# EAGLE design nucleum_logger (EAGLE 6.6.0)
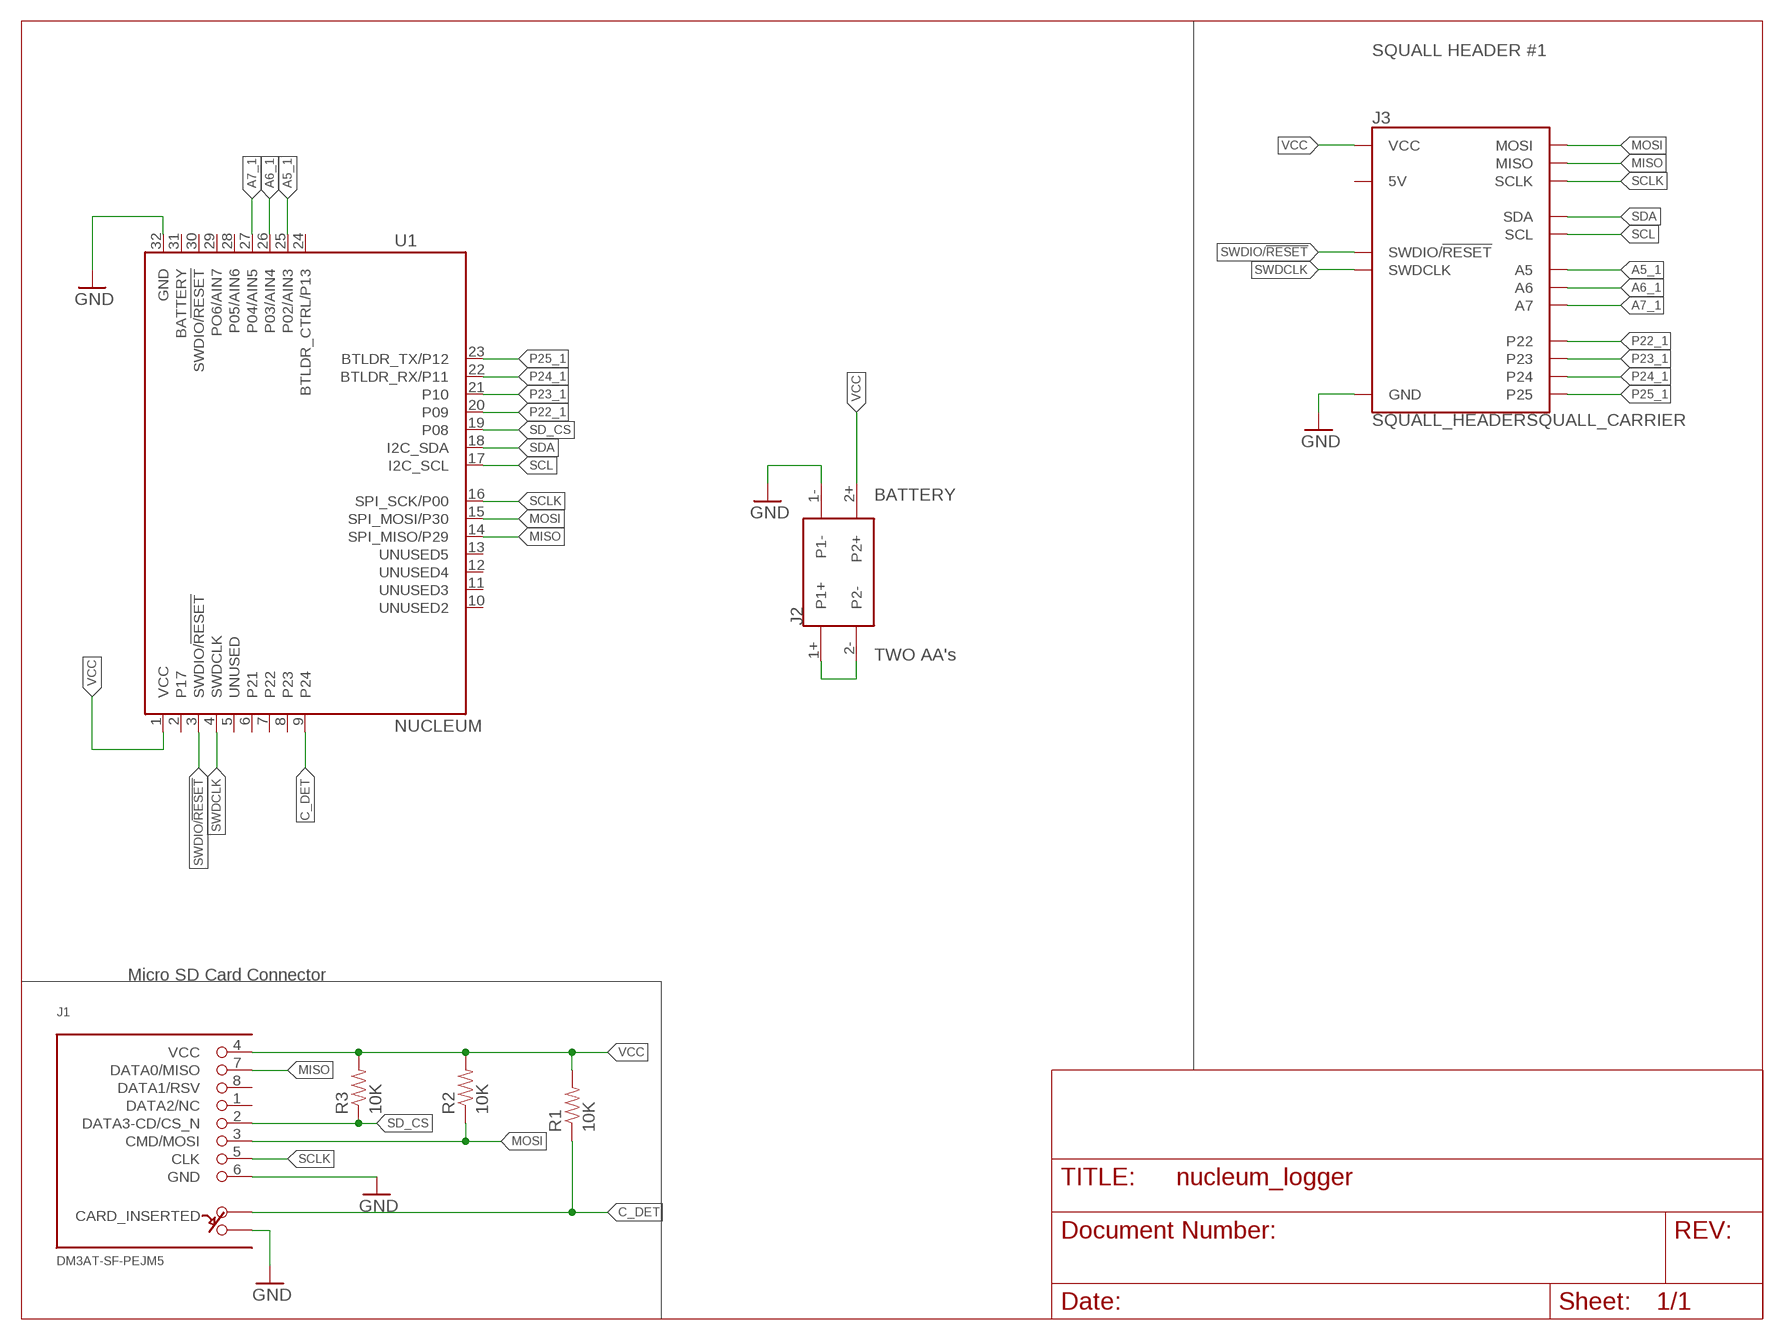
[diagram p0: schematic, sheet 1]

## Parts
J1  DM3AT-SF-PEJM5  [DM3AT-SF-PEJM5]
J2  AA_BAT_PACKSMD  [AA_SMD]
J3  SQUALL_HEADERSQUALL_CARRIER  [SQUALL_CARRIER]
R1  10K  RESISTOR0402_RES  [0402_RES]
R2  10K  RESISTOR0402_RES  [0402_RES]
R3  10K  RESISTOR0402_RES  [0402_RES]
U1  NUCLEUM  [NUCLEUM]

## Nets
A5_1: J3.B9(A5) U1.25(P02/AIN3)
A6_1: J3.B7(A6) U1.26(P03/AIN4)
A7_1: J3.B5(A7) U1.27(P04/AIN5)
C_DET: J1.A R1.1 U1.9(P24)
GND: J1.6(GND) J1.B J2.1- J3.A9(GND) J3.A10(GND) U1.32(GND)
MISO: J1.7(DATA0/MISO) J3.B8(MISO) U1.14(SPI_MISO/P29)
MOSI: J1.3(CMD/MOSI) J3.B6(MOSI) R2.1 U1.15(SPI_MOSI/P30)
N$1: J2.1+ J2.2-
P22_1: J3.A2(P22) U1.20(P09)
P23_1: J3.A4(P23) U1.21(P10)
P24_1: J3.A6(P24) U1.22(BTLDR_RX/P11)
P25_1: J3.A8(P25) U1.23(BTLDR_TX/P12)
SCL: J3.B3(SCL) U1.17(I2C_SCL)
SCLK: J1.5(CLK) J3.B10(SCLK) U1.16(SPI_SCK/P00)
SD_CS: J1.2(DATA3-CD/CS_N) R3.1 U1.19(P08)
SDA: J3.B1(SDA) U1.18(I2C_SDA)
SWDCLK: J3.B2(SWDCLK) U1.4(SWDCLK)
SWDIO/!RESET: J3.B4(SWDIO/!RESET) U1.3(SWDIO/!RESET)
VCC: J1.4(VCC) J2.2+ J3.A1(VCC) J3.A3(VCC) R1.2 R2.2 R3.2 U1.1(VCC)
Unconnected: J1.1(DATA2/NC) J1.8(DATA1/RSV) J3.A5(5V) J3.A7(5V) U1.2(P17) U1.5(UNUSED) U1.6(P21) U1.7(P22) U1.8(P23) U1.10(UNUSED2) U1.11(UNUSED3) U1.12(UNUSED4) U1.13(UNUSED5) U1.24(BTLDR_CTRL/P13) U1.28(P05/AIN6) U1.29(PO6/AIN7) U1.30(SWDIO/!RESET) U1.31(BATTERY)

## Notes on the sheet
- SQUALL HEADER #1
- BATTERY
- TWO AA's
- Micro SD Card Connector

## Library data of the parts
J1 = connector:DM3AT-SF-PEJM5: CONN MICRO SD R/A PUSH-PUSH SMD; DIGIKEY: HR1964CT-ND
J2 = connector:AA_BAT_PACK: Types of AA Battery Packs
J3 = squall:SQUALL_HEADER: Header for a sensor board on top of the Squall BLE tag board. Requires two DF40C-10DS-0.4V(51).
R1-R3 = passives:RESISTOR: Resistor Basic schematic elements and footprints for 0603, 1206, and PTH resistors.
U1 = nucleum:NUCLEUM: Nucleum sensorboard prototyping module.

## Board
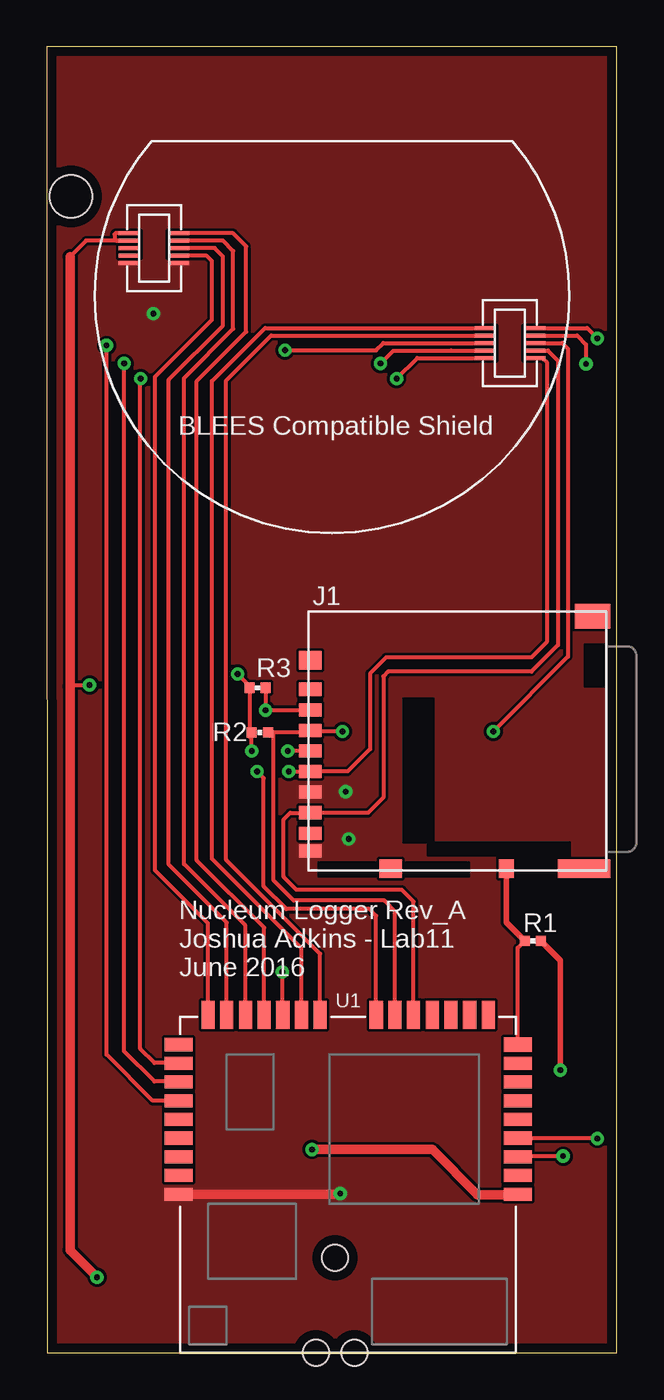
[diagram p1: board, top side]
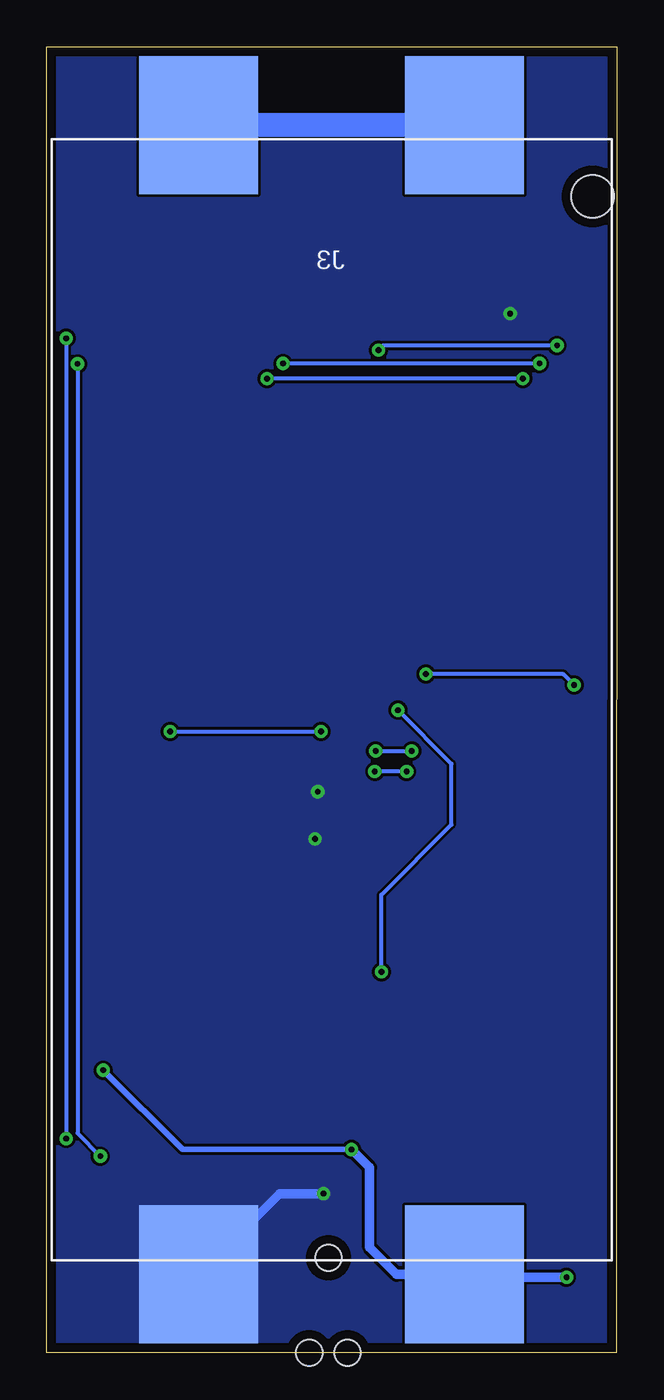
[diagram p2: board, bottom side, seen from below]

Size 30.51 x 69.85 mm. Coordinates in mm from the lower left corner, seen from the top.
Outline: 0.03,0 30.51,0 30.51,69.85 0,69.85 0.03,0
Copper layers (1*16): Top 0.0178mm / dielectric 59mil / Bottom 0.0178mm
Design rules "sunstone-2lyr_v1.0.0.3": minimum track width 6mil, minimum drill 14mil, track to track 6mil, track to pad 6mil, pad to pad 6mil, via to via 6mil, smd to smd 6mil, copper to edge 20mil, drill to drill 16mil, minimum pad ring 8mil, minimum via ring 8mil, stop-mask expansion 3mil, vias tented up to drill 50mil, thermal gap 10mil

### Footprints (pad centres in the part's own frame; a part is rotated, then mirrored left to right if it is on the bottom)
DM3AT-SF-PEJM5 = smd 0.7 x 1.2: 1 3.2,-0.1; 2 2.1,-0.1; 3 1,-0.1; 4 -0.1,-0.1; 5 -1.2,-0.1; 6 -2.3,-0.1; 7 -3.4,-0.1; 8 -4.5,-0.1; B -5.45,-0.1 | smd 1 x 0.8: A -6.4,-10.6 | smd 1 x 1.2: MOUNT0 4.75,-0.1; MOUNT1 -6.4,-4.4 | smd 1 x 2.8: MOUNT2 -6.4,-14.75 | smd 1.3 x 1.9: MOUNT3 7.1,-15.2
AA_SMD = smd 6.35 x 7.366: 1+ -7.112,30.734; 1- -7.112,-30.734; 2+ 7.112,-30.734; 2- 7.112,30.734 | hole 2.286: 13.97,26.924
SQUALL_CARRIER = smd 1.14 x 0.2: A1 -10.845,3.34; A2 -8.205,3.34; A3 -10.845,2.94; A4 -8.205,2.94; A5 -10.845,2.54; A6 -8.205,2.54; A7 -10.845,2.14; A8 -8.205,2.14; A9 -10.845,1.74; A10 -8.205,1.74; B1 8.205,-1.74; B2 10.845,-1.74; B3 8.205,-2.14; B4 10.845,-2.14; B5 8.205,-2.54; B6 10.845,-2.54; B7 8.205,-2.94; B8 10.845,-2.94; B9 8.205,-3.34; B10 10.845,-3.34
0402_RES = smd 0.536 x 0.546: 1 -0.433,0; 2 0.433,0
NUCLEUM = smd 0.7 x 1.5: 1 -9.479,-9.079; 2 -8.479,-9.079; 3 -7.479,-9.079; 4 -6.479,-9.079; 5 -5.479,-9.079; 6 -4.479,-9.079; 7 -3.479,-9.079; 8 -2.479,-9.079; 24 -1.479,9.079; 25 -2.479,9.079; 26 -3.479,9.079; 27 -4.479,9.079; 28 -5.479,9.079; 29 -6.479,9.079; 30 -7.479,9.079; 31 -8.479,9.079; 32 -9.479,9.079 | smd 0.754 x 1.5: 9 -1.479,-9.079 | smd 1.5 x 0.7: 10 0.1,-7.5; 11 0.1,-6.5; 12 0.1,-5.5; 13 0.1,-4.5; 14 0.1,-3.5; 15 0.1,-2.5; 16 0.1,-1.5; 17 0.1,1.5; 18 0.1,2.5; 19 0.1,3.5; 20 0.1,4.5; 21 0.1,5.5; 22 0.1,6.5; 23 0.1,7.5 | hole 1.4: -17.96,-0.33; -17.96,1.72; -12.88,0.7

### Placement (x,y rotation side)
J1  14,32.28 90 top
J2  15.27,34.92 0 bottom
J3  15.27,56.54 0 top
R1  26.01,22.02 0 top
R2  11.4,33.17 180 top
R3  11.28,35.56 180 top
U1  16.13,17.96 90 top

### Tracks (layer width: path | path; a pad name or v marks a point on that pad's centre or on a via)
A5_1  (via drill 0.3 pad 0.61)
  Top 0.203: U1.25 7.04,15.49 5.77,15.49 5,16.26 5,52.09 v5.03,52.09 | v18.72,52.09 19.82,53.2 J3.B9
  Bottom 0.203: v5.03,52.09 v18.72,52.09
A6_1  (via drill 0.3 pad 0.61)
  Top 0.203: U1.26 7.03,14.5 5.77,14.5 4.14,16.13 v4.14,52.91 | v17.86,52.91 18.54,53.59 21.51,53.59 21.63,53.6 J3.B7
  Bottom 0.203: v4.14,52.91 v17.86,52.91
A7_1  (via drill 0.3 pad 0.61)
  Top 0.203: U1.27 5.67,13.48 3.2,15.95 v3.2,53.87 | v12.75,53.62 17.63,53.62 18.01,54 J3.B5
  Bottom 0.203: v3.2,53.87 12.5,53.87 v12.75,53.62
C_DET
  Top 0.203: U1.9 25.21,21.65 R1.1 | 24.71,25.77 J1.A
  Top 0.305: R1.1 24.6,23 J1.A
GND  (via drill 0.3 pad 0.61)
  Top 0.508: U1.32 15.67,8.48 v15.7,8.51
  Bottom 0.508: v15.7,8.51 18.06,8.51 J2.1-
  other vias: 16,30 16.15,27.48 5.72,55.58
  pour Top (no thermals): 0.03,0 -0.03,69.88 30.48,69.85 30.51,0.03
  pour Bottom (no thermals): 0.03,0 -0.03,69.88 30.48,69.85 30.51,0.03
MISO
  Top 0.203: U1.14 19.63,24.14 19,24.77 13.36,24.77 12.67,25.45 12.67,28.52 13.03,28.88 J1.7 17.2,28.88 18.01,29.69 18.01,36.17 18.26,36.42 25.93,36.42 27.36,37.85 27.36,53.06 26.82,53.6 J3.B8
MOSI  (via drill 0.3 pad 0.61)
  Top 0.203: U1.15 18.63,23.61 18.06,24.18 13.21,24.18 12.14,25.25 12.14,33.2 | 12.14,33.2 14.01,33.2 J1.3 14.16,33.22 v15.82,33.22 | 12.14,33.2 R2.1 | J3.B6 27.58,54 27.89,53.7 27.89,37.24 v23.9,33.22
  Bottom 0.203: v23.9,33.22 v15.82,33.22
N$1
  Bottom 1.27: J2.2- J2.1+
P22_1
  Top 0.203: U1.20 11.63,22.74 8.03,26.34 8.03,51.97 10.67,54.61 10.67,59.18 9.98,59.87 7.07,59.87 J3.A2
P23_1
  Top 0.203: U1.21 10.63,22.85 7.34,26.14 7.34,52.12 9.98,54.76 9.98,58.93 9.42,59.49 J3.A4
P24_1
  Top 0.203: U1.22 9.63,23.01 6.53,26.11 6.53,52.05 9.42,54.94 9.42,58.62 8.99,59.08 J3.A6
P25_1
  Top 0.203: U1.23 8.63,22.97 5.79,25.81 5.79,52.2 8.84,55.24 8.84,58.4 8.56,58.67 J3.A8
SCL
  Top 0.203: U1.17 14.63,21.34 9.6,26.36 9.6,51.99 12.01,54.41 J3.B3
SCLK  (via drill 0.3 pad 0.61)
  Top 0.203: U1.16 17.63,23.37 17.27,23.72 12.83,23.72 11.61,24.94 11.61,30.73 v11.25,31.09 | v12.95,31.09 J1.5 16.1,31.09 17.3,32.28 17.3,36.32 18.16,37.19 25.93,37.19 26.75,38 26.75,52.98 26.53,53.2 J3.B10
  Bottom 0.203: v11.25,31.09 v12.95,31.09
SD_CS  (via drill 0.3 pad 0.61)
  Top 0.203: 14.09,34.39 J1.2 14.08,34.37 v11.71,34.37 R3.1 | U1.19 12.63,20.34 v12.6,20.37
  Bottom 0.203: v12.6,20.37 12.6,24.49 8.84,28.25 8.84,31.5 v11.71,34.37
SDA
  Top 0.203: U1.18 13.63,21.63 8.84,26.42 8.84,51.97 11.68,54.81 23.46,54.81 J3.B1
SWDCLK  (via drill 0.3 pad 0.61)
  Top 0.203: J3.B2 28.92,54.8 v29.46,54.25 | v29.46,11.46 25.23,11.46 U1.4
  Bottom 0.203: v29.46,54.25 v29.46,11.46
SWDIO/!RESET  (via drill 0.3 pad 0.61)
  Top 0.203: J3.B4 28.38,54.4 28.85,53.92 v28.85,52.88 | v27.64,10.52 25.24,10.52 U1.3
  Bottom 0.203: v28.85,52.88 28.85,11.73 v27.64,10.52
VCC  (via drill 0.3 pad 0.61)
  Top 0.203: J3.A1 3.7,59.88 3.63,59.82 3.63,59.54 3.68,59.49 J3.A3 2.1,59.48 1.24,58.62 | J1.4 v12.9,32.18 | v10.97,32.18 R2.2 10.84,32.94 R3.2 10.84,35.66 v10.21,36.3 | 1.24,35.64 1.32,35.71 v2.29,35.71
  Top 0.305: R1.2 27.48,20.98 v27.48,15.11
  Top 0.508: v14.2,10.87 20.62,10.87 23.04,8.46 25.19,8.46 U1.1 | 1.24,58.62 1.24,35.64 1.24,5.49 v2.69,4.04
  Bottom 0.203: v12.9,32.18 v10.97,32.18 | v2.29,35.71 2.87,36.3 v10.21,36.3
  Bottom 0.305: v27.48,15.11 23.24,10.87 v14.2,10.87
  Bottom 0.508: J2.2+ 8.92,4.19 | 8.92,4.19 11.79,4.19 13.23,5.64 13.23,9.91 v14.2,10.87 | v2.69,4.04 8.1,4.04 8.41,3.73 8.46,3.73 8.92,4.19

### Text on the board
tNames: BLEES Compatible Shield | Nucleum Logger Rev_A / Joshua Adkins - Lab11 / June 2016